# EAGLE design ChessPCB (EAGLE 9.6.2)
AUTHOR: C.AGENA, A.HUDAK; BOARD_NAME: CHESS_PCB; DOC_NUM: 1; PROJECT_NAME: CHESS_ROBOT; REVISION: 1
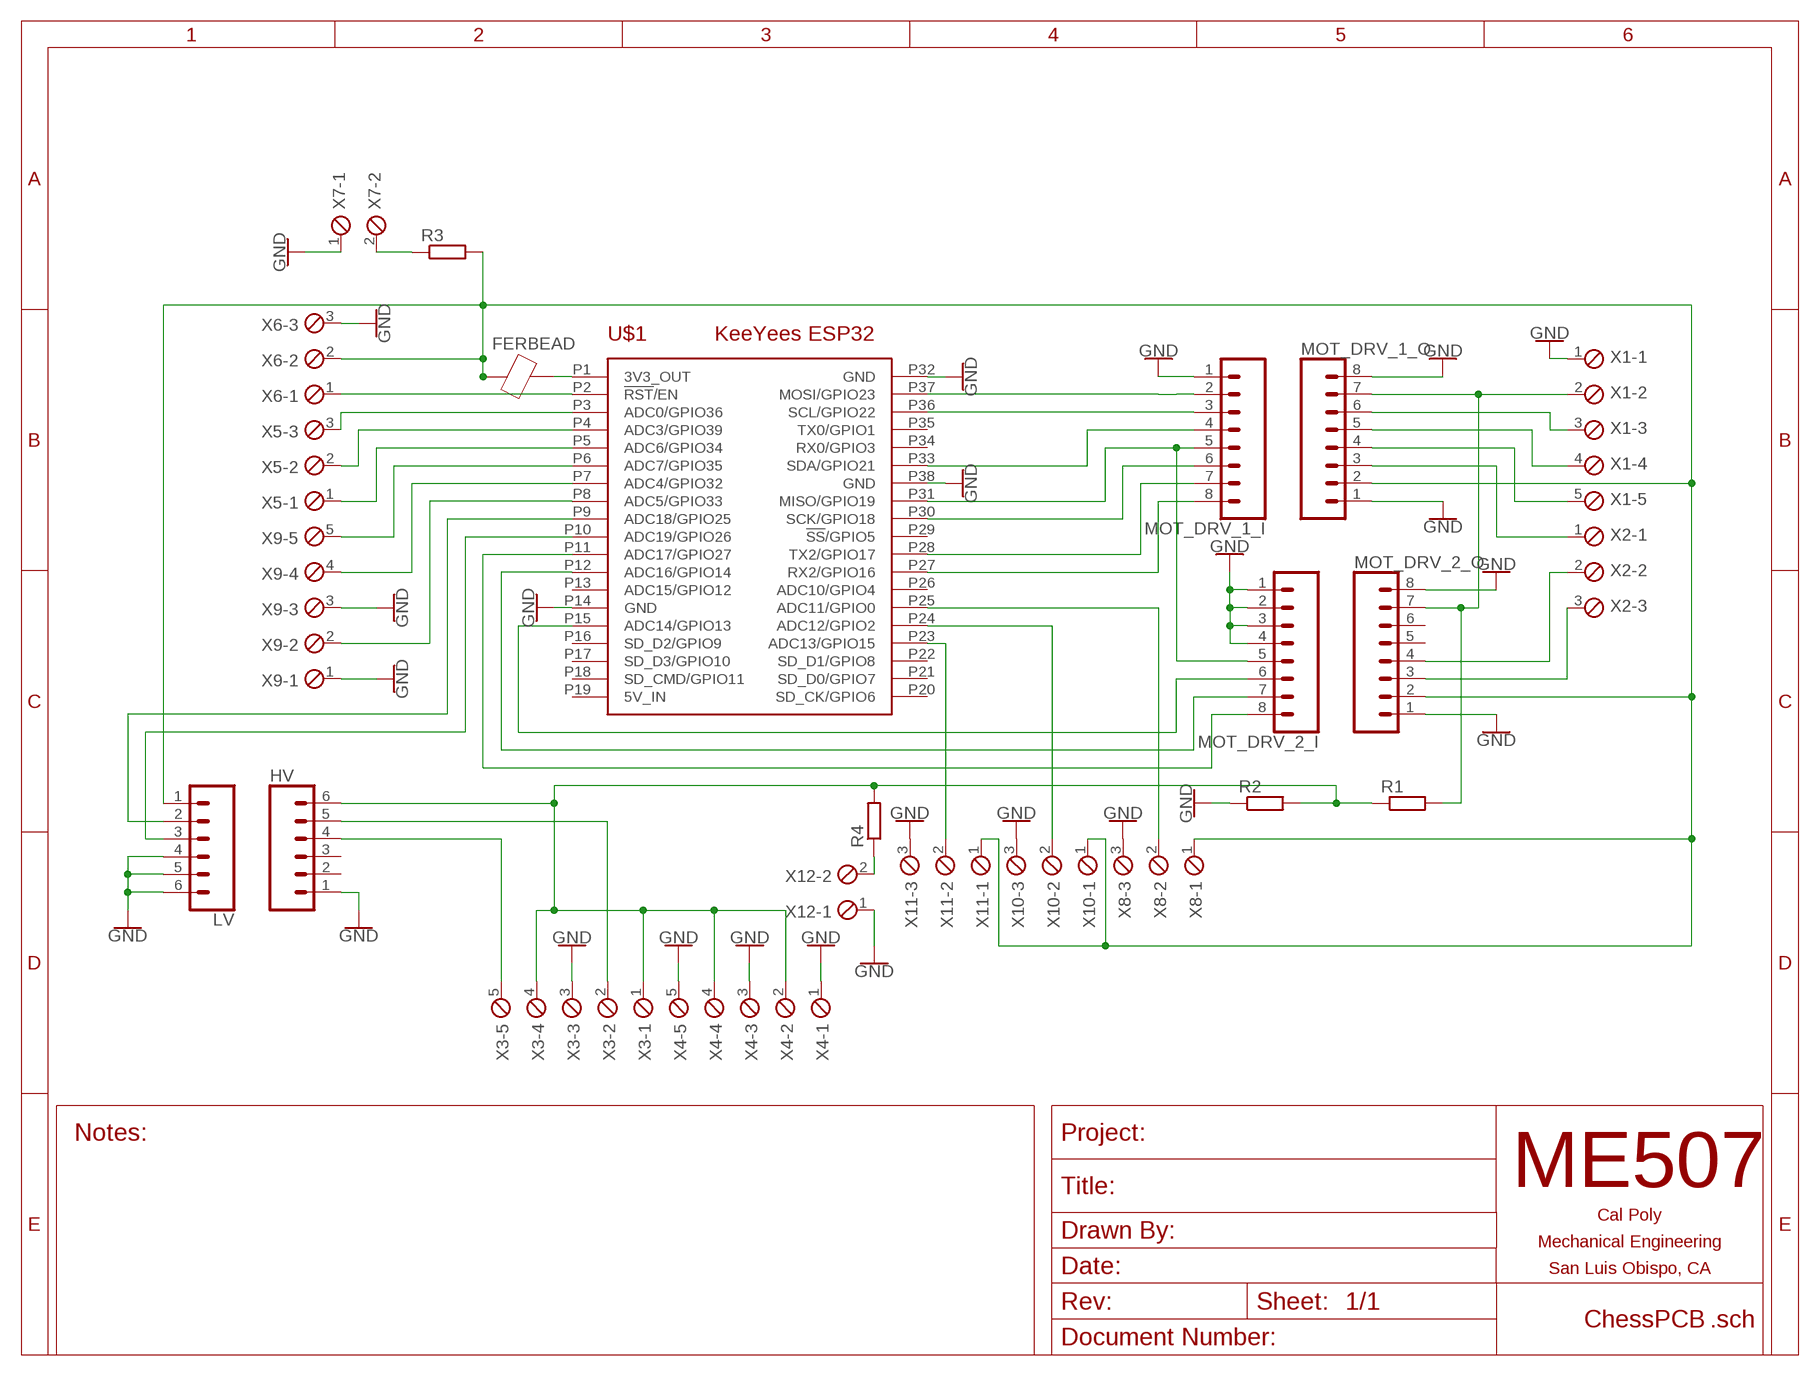
[diagram p0: schematic, sheet 1]

## Parts
FERBEAD  BEAD0402  [0402]
HV  CONN_06SILK_FEMALE_PTH  [1X06]
LV  CONN_06SILK_FEMALE_PTH  [1X06]
MOT_DRV_1_I  CONN_08"  [1X08]
MOT_DRV_1_O  CONN_08"  [1X08]
MOT_DRV_2_I  CONN_08"  [1X08]
MOT_DRV_2_O  CONN_08"  [1X08]
R1  R-EU_0204/7  [0204/7]
R2  R-EU_0204/7  [0204/7]
R3  R-EU_0204/7  [0204/7]
R4  R-EU_0204/7  [0204/7]
U$1  KEEYEES_ESP32  [KEEYEES_ESP32]
X1  SCREWTERM_5P_254  [5POL254]
X2  SCREWTERM_3P_254  [3POL254]
X3  SCREWTERM_5P_254  [5POL254]
X4  SCREWTERM_5P_254  [5POL254]
X5  SCREWTERM_3P_254  [3POL254]
X6  SCREWTERM_3P_254  [3POL254]
X7  SCREWTERM_2P_254  [2POL254]
X8  SCREWTERM_3P_254  [3POL254]
X9  SCREWTERM_5P_254  [5POL254]
X10  SCREWTERM_3P_254  [3POL254]
X11  SCREWTERM_3P_254  [3POL254]
X12  SCREWTERM_2P_254  [2POL254]

## Nets
GND: HV.1 LV.4 LV.5 LV.6 MOT_DRV_1_I.1 MOT_DRV_1_O.1 MOT_DRV_1_O.8 MOT_DRV_2_I.1 MOT_DRV_2_I.2 MOT_DRV_2_I.3 MOT_DRV_2_I.4 MOT_DRV_2_O.1 MOT_DRV_2_O.8 R2.1 U$1.P14(GND) U$1.P32(GND) U$1.P38(GND) X1.1 X3.3 X4.1 X4.3 X4.5 X6.3 X7.1 X8.3 X9.1 X9.3 X10.3 X11.3 X12.1
N$1: MOT_DRV_1_I.2 U$1.P37(MOSI/GPIO23)
N$2: MOT_DRV_1_I.3 U$1.P36(SCL/GPIO22)
N$3: MOT_DRV_1_I.4 U$1.P33(SDA/GPIO21)
N$4: MOT_DRV_1_I.6 U$1.P30(SCK/GPIO18)
N$5: MOT_DRV_1_I.7 U$1.P28(TX2/GPIO17)
N$6: MOT_DRV_1_I.8 U$1.P27(RX2/GPIO16)
N$7: MOT_DRV_1_I.5 MOT_DRV_2_I.5 U$1.P31(MISO/GPIO19)
N$8: LV.3 U$1.P10(ADC19/GPIO26)
N$9: MOT_DRV_2_I.8 U$1.P11(ADC17/GPIO27)
N$10: MOT_DRV_2_I.7 U$1.P12(ADC16/GPIO14)
N$11: MOT_DRV_2_I.6 U$1.P15(ADC14/GPIO13)
N$12: U$1.P3(ADC0/GPIO36) X5.3
N$13: U$1.P4(ADC3/GPIO39) X5.2
N$14: U$1.P5(ADC6/GPIO34) X5.1
N$15: U$1.P6(ADC7/GPIO35) X9.5
N$16: U$1.P7(ADC4/GPIO32) X9.4
N$17: LV.2 U$1.P9(ADC18/GPIO25)
N$18: U$1.P8(ADC5/GPIO33) X9.2
N$19: MOT_DRV_2_O.3 X2.3
N$20: FERBEAD.2 U$1.P1(3V3_OUT)
N$21: MOT_DRV_2_O.4 X2.2
N$22: R3.1 X7.2
N$23: FERBEAD.1 LV.1 MOT_DRV_1_O.2 MOT_DRV_2_O.2 R3.2 X6.2 X8.1 X10.1 X11.1
N$24: HV.6 R1.1 R2.2 R4.2 X3.1 X3.4 X4.2 X4.4
N$25: U$1.P25(ADC11/GPIO0) X8.2
N$26: U$1.P24(ADC12/GPIO2) X10.2
N$27: U$1.P23(ADC13/GPIO15) X11.2
N$28: U$1.P2(!RST!/EN) X6.1
N$29: HV.5 X3.2
N$30: MOT_DRV_1_O.7 MOT_DRV_2_O.7 R1.2 X1.2
N$31: HV.4 X3.5
N$32: R4.1 X12.2
N$33: MOT_DRV_1_O.6 X1.3
N$36: MOT_DRV_1_O.5 X1.4
N$37: MOT_DRV_1_O.4 X1.5
N$38: MOT_DRV_1_O.3 X2.1
Unconnected: HV.2 HV.3 MOT_DRV_2_O.5 MOT_DRV_2_O.6 U$1.P13(ADC15/GPIO12) U$1.P16(SD_D2/GPIO9) U$1.P17(SD_D3/GPIO10) U$1.P18(SD_CMD/GPIO11) U$1.P20(SD_CK/GPIO6) U$1.P21(SD_D0/GPIO7) U$1.P22(SD_D1/GPIO8) U$1.P26(ADC10/GPIO4) U$1.P29(!SS!/GPIO5) U$1.P34(RX0/GPIO3) U$1.P35(TX0/GPIO1)

## Power pins joined to a net without a drawn wire
5V_IN: U$1.P19(5V_IN)

## Library data of the parts
FERBEAD = ME507:BEAD: Ferrite Bead
HV LV = SparkFun-Connectors:CONN_06: Multi connection point. Often used as Generic Header-pin footprint for 0.1 inch spaced/style header connections On any of the 0.1 inch spaced packages, you can populate with these: Break Away Headers - Straight <https://www.sparkfun.com/products/116> (PRT-00116) Break Away Male Headers - Right Angle <https://www.sparkfun.com/products/553> (PRT-00553) Female Headers <https://www.sparkfun.com/products/115> (PRT-00115) Break Away Headers - Machine Pin <https://www.sparkfun.com/products/117> (PRT-00117) Break Away Female Headers - Swiss Machine Pin <https://www.sparkfun.com/products/743> (PRT-00743) Arduino Stackable Header - 6 Pin <https://www.sparkfun.com/products/9280> (PRT-09280) For SCREWTERMINALS and SPRING TERMINALS visit here: Screw Terimnals on SparkFun.com <https://www.sparkfun.com/search/results?term=Screw+Terminals> (5mm/3.5mm/2.54mm spacing) This device is also useful as a general connection point to wire up your design to another part of your project. Our various solder wires solder well into these plated through hole pads. Hook-Up Wire - Assortment (Stranded, 22 AWG) <https://www.sparkfun.com/products/11375> (PRT-11375) Hook-Up Wire - Assortment (Solid Core, 22 AWG) <https://www.sparkfun.com/products/11367> (PRT-11367) View the entire wire category on our website here <https://www.sparkfun.com/categories/141>; PROD_ID: CONN-08437
MOT_DRV_1_I MOT_DRV_1_O MOT_DRV_2_I MOT_DRV_2_O = SparkFun-Connectors:CONN_08: Multi connection point. Often used as Generic Header-pin footprint for 0.1 inch spaced/style header connections On any of the 0.1 inch spaced packages, you can populate with these: Break Away Headers - Straight <https://www.sparkfun.com/products/116> (PRT-00116) Break Away Male Headers - Right Angle <https://www.sparkfun.com/products/553> (PRT-00553) Female Headers <https://www.sparkfun.com/products/115> (PRT-00115) Break Away Headers - Machine Pin <https://www.sparkfun.com/products/117> (PRT-00117) Break Away Female Headers - Swiss Machine Pin <https://www.sparkfun.com/products/743> (PRT-00743) Arduino Stackable Header - 8 Pin <https://www.sparkfun.com/products/9279> (PRT-09279) For SCREWTERMINALS and SPRING TERMINALS visit here: Screw Terimnals on SparkFun.com <https://www.sparkfun.com/search/results?term=Screw+Terminals> (5mm/3.5mm/2.54mm spacing) This device is also useful as a general connection point to wire up your design to another part of your project. Our various solder wires solder well into these plated through hole pads. Hook-Up Wire - Assortment (Stranded, 22 AWG) <https://www.sparkfun.com/products/11375> (PRT-11375) Hook-Up Wire - Assortment (Solid Core, 22 AWG) <https://www.sparkfun.com/products/11367> (PRT-11367) View the entire wire category on our website here <https://www.sparkfun.com/categories/141> Special notes: Molex polarized connector foot print use with SKU : PRT-08231 with associated crimp pins and housings. 1MM SMD Version SKU: PRT-10208 NOTES ON THE VARIANTS LOCK and LOCK_LONGPADS... This footprint was designed to help hold the alignment of a through-hole component (i.e. 6-pin header) while soldering it into place. You may notice that each hole has been shifted either up or down by 0.005 of an inch from it's more standard position (which is a perfectly straight line). This slight alteration caused the pins (the squares in the middle) to touch the edges of the holes. Because they are alternating, it causes a "brace" to hold the component in place. 0.005 has proven to be the perfect amount of "off-center" position when using our standard breakaway headers. Although looks a little odd when you look at the bare footprint, once you have a header in there, the alteration is very hard to notice. Also,if you push a header all the way into place, it is covered up entirely on the bottom side.; PROD_ID: CONN-08438
R1-R4 = rcl:R-EU_: RESISTOR, European symbol; SPICEPREFIX: R
U$1 = ME507:KEEYEES_ESP32: Footprint for an add-on board (shield, hat, etc.) for a KeeYees ESP32 development board with ESP-WROOM-32 module. 38 pins.
X1 X3 X4 X9 = ME507:SCREWTERM_5P: Screw Terminal Block This part is designed for a screw terminal connector. The 2.54mm (0.100 inch) foorprint can also be used for male or female pin headers such as those on most development boards. One can also solder wires directly into the holes, though this makes modifications or repairs to the system more inconvenient. Larger versions can carry more current.
X2 X5 X6 X8 X10 X11 = ME507:SCREWTERM_3P: Screw Terminal Block This part is designed for a screw terminal connector. The 2.54mm (0.100 inch) foorprint can also be used for male or female pin headers such as those on most development boards. One can also solder wires directly into the holes, though this makes modifications or repairs to the system more inconvenient. Larger versions can carry more current.
X7 X12 = ME507:SCREWTERM_2P: Screw Terminal Block This part is designed for a screw terminal connector. The 2.54mm (0.100 inch) foorprint can also be used for male or female pin headers such as those on most development boards. One can also solder wires directly into the holes, though this makes modifications or repairs to the system more inconvenient. Larger versions can carry more current.

## Board
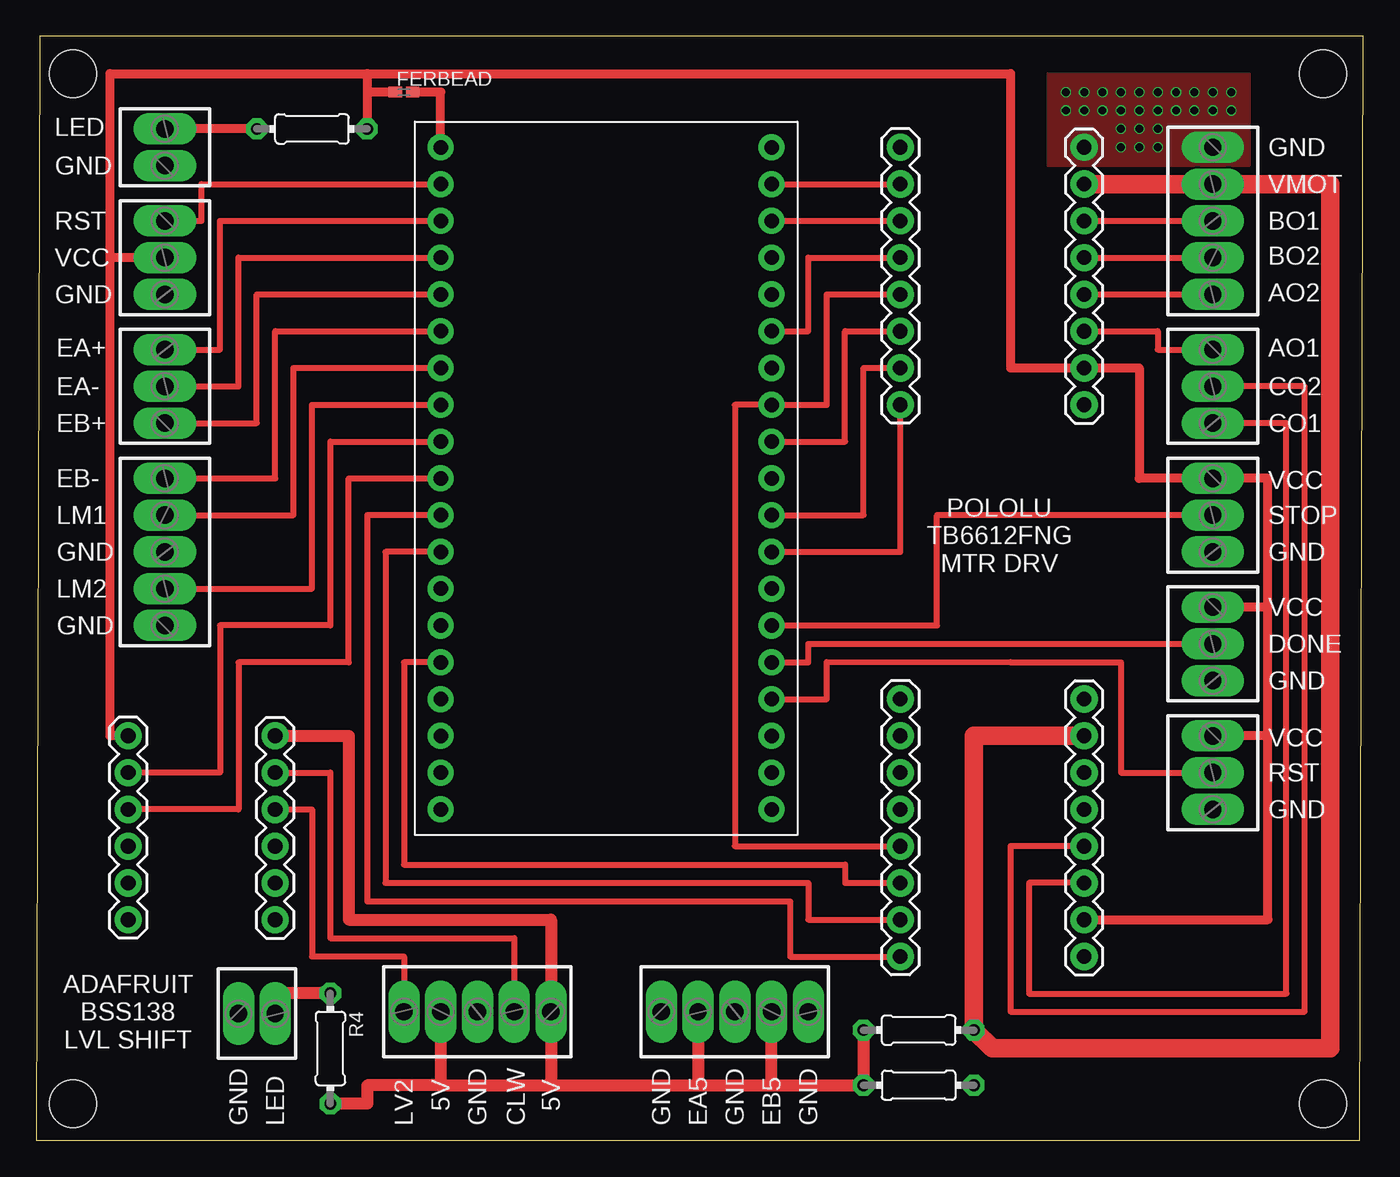
[diagram p1: board, top side]
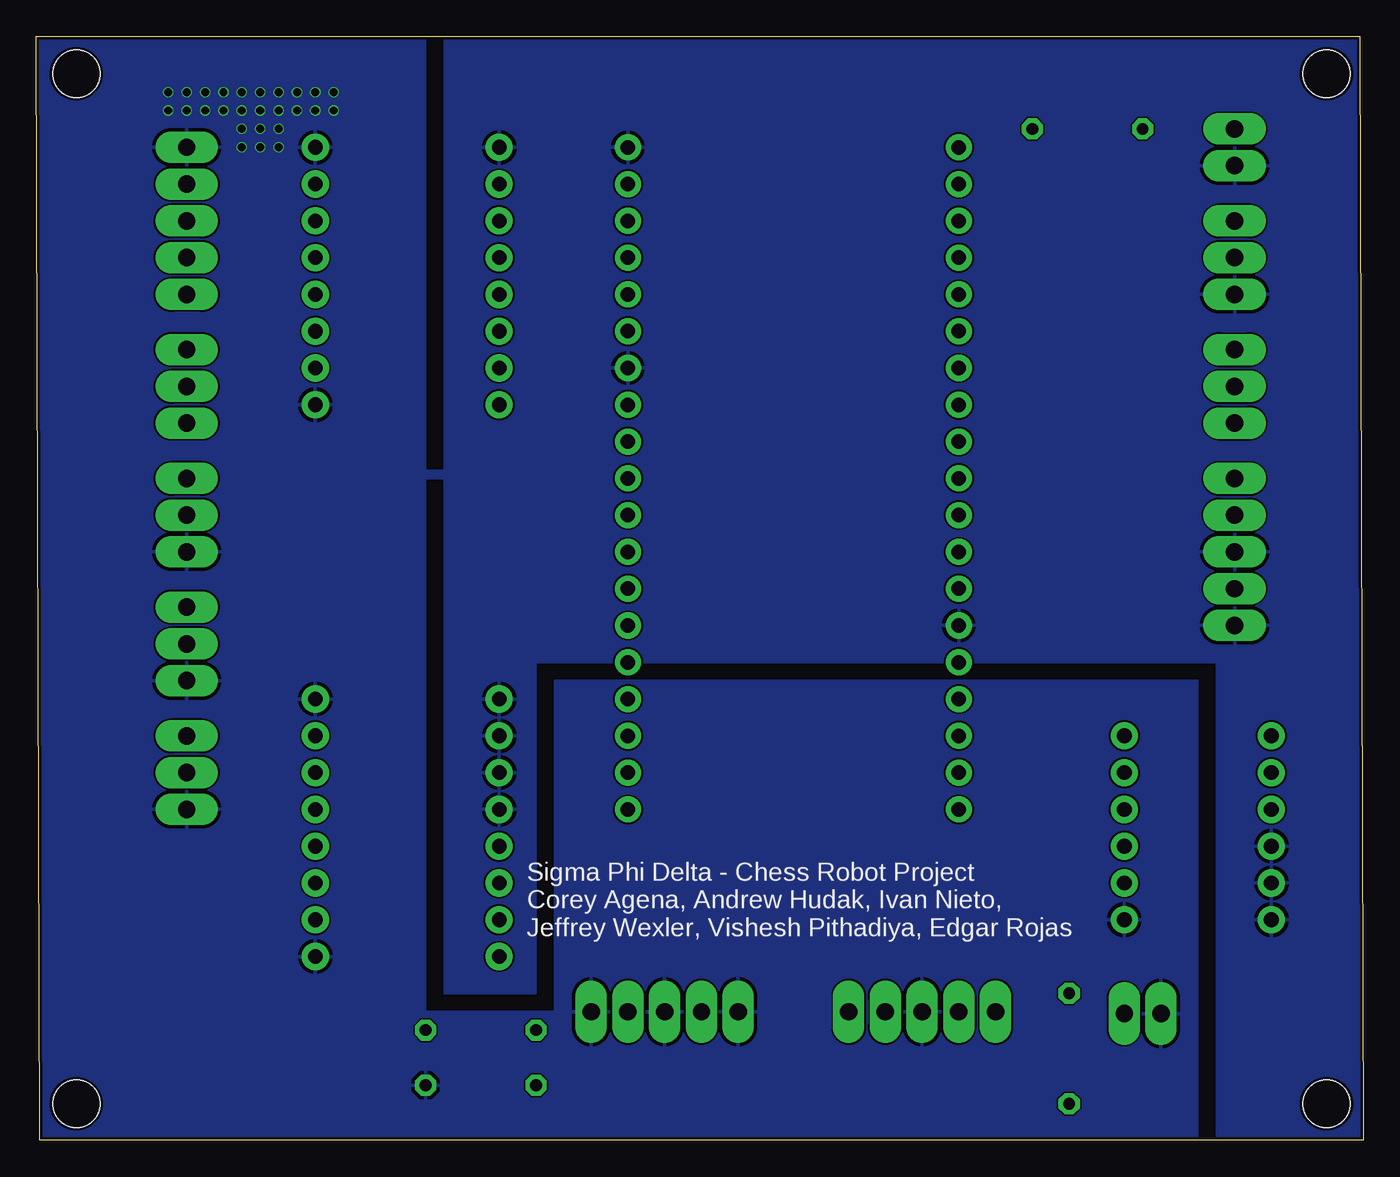
[diagram p2: board, bottom side, seen from below]

Size 91.67 x 76.25 mm. Coordinates in mm from the lower left corner, seen from the top.
Outline: 0,0 91.42,0 91.67,76.25 0.25,76.25 0,0
Copper layers (1*16): Top 0.035mm / dielectric 1.6mm / Bottom 0.035mm
Design rules "jlcpcb-2layers": minimum track width 5mil, minimum drill 0.3mm, track to track 5mil, track to pad 5mil, pad to pad 5mil, via to via 5mil, smd to smd 5mil, copper to edge 0.2mm, drill to drill 6mil, minimum pad ring 10mil, minimum via ring 3mil, stop-mask expansion 4mil, vias tented up to drill 0mil, thermal gap 10mil
Holes 3.26 mm at 2.54,73.66 2.54,2.54 88.9,73.66 88.9,2.54

### Footprints (pad centres in the part's own frame; a part is rotated, then mirrored left to right if it is on the bottom)
0402 = smd 0.925 x 0.74: 1 -0.6,0; 2 0.6,0
1X06 = drill 1.016 pad 1.88: 1 0,0; 2 2.54,0; 3 5.08,0; 4 7.62,0; 5 10.16,0; 6 12.7,0
1X08 = drill 1.016 pad 1.88: 1 0,0; 2 2.54,0; 3 5.08,0; 4 7.62,0; 5 10.16,0; 6 12.7,0; 7 15.24,0; 8 17.78,0
0204/7 = drill 0.813 octagon: 1 -3.81,0; 2 3.81,0
KEEYEES_ESP32 = drill 1 pad 1.778: P1 -11.43,21.59; P2 -11.43,19.05; P3 -11.43,16.51; P4 -11.43,13.97; P5 -11.43,11.43; P6 -11.43,8.89; P7 -11.43,6.35; P8 -11.43,3.81; P9 -11.43,1.27; P10 -11.43,-1.27; P11 -11.43,-3.81; P12 -11.43,-6.35; P13 -11.43,-8.89; P14 -11.43,-11.43; P15 -11.43,-13.97; P16 -11.43,-16.51; P17 -11.43,-19.05; P18 -11.43,-21.59; P19 -11.43,-24.13; P20 11.43,-24.13; P21 11.43,-21.59; P22 11.43,-19.05; P23 11.43,-16.51; P24 11.43,-13.97; P25 11.43,-11.43; P26 11.43,-8.89; P27 11.43,-6.35; P28 11.43,-3.81; P29 11.43,-1.27; P30 11.43,1.27; P31 11.43,3.81; P32 11.43,6.35; P33 11.43,8.89; P34 11.43,11.43; P35 11.43,13.97; P36 11.43,16.51; P37 11.43,19.05; P38 11.43,21.59
5POL254 = drill 1.2 long: 1 -5.08,0; 2 -2.54,0; 3 0,0; 4 2.54,0; 5 5.08,0
3POL254 = drill 1.2 long: 1 -2.54,0; 2 0,0; 3 2.54,0
2POL254 = drill 1.2 long: 1 -1.27,0; 2 1.27,0

### Placement (x,y rotation side)
FERBEAD  25.4,72.39 0 top
HV  16.51,15.24 90 top
LV  6.35,27.94 270 top
MOT_DRV_1_I  59.69,68.58 270 top
MOT_DRV_1_O  72.39,50.8 90 top
MOT_DRV_2_I  59.69,30.48 270 top
MOT_DRV_2_O  72.39,12.7 90 top
R1  60.96,7.62 0 top
R2  60.96,3.81 180 top
R3  19.05,69.85 0 top
R4  20.32,6.35 270 top
U$1  39.37,46.99 0 top
X1  81.28,63.5 270 top
X2  81.28,52.07 270 top
X3  30.48,8.89 180 top
X4  48.26,8.89 0 top
X5  8.89,52.07 90 top
X6  8.89,60.96 270 top
X7  8.89,68.58 90 top
X8  81.28,43.18 270 top
X9  8.89,40.64 90 top
X10  81.28,34.29 270 top
X11  81.28,25.4 270 top
X12  15.24,8.76 0 top

### Tracks (layer width: path | path; a pad name or v marks a point on that pad's centre or on a via)
GND  (via drill 0.55)
  other vias: 71.12,72.39 72.39,72.39 73.66,72.39 82.55,71.12 71.12,71.12 72.39,71.12 74.93,72.39 76.2,72.39 77.47,72.39 81.28,72.39 82.55,72.39 78.74,72.39 80.01,72.39 73.66,71.12 74.93,71.12 76.2,71.12 77.47,71.12 78.74,71.12 80.01,71.12 81.28,71.12 74.93,69.85 76.2,69.85 77.47,69.85 74.93,68.58 76.2,68.58 77.47,68.58
  pour Top (no thermals): 71.12,67.31 83.82,67.31 83.82,73.66 69.85,73.66 69.85,67.31
  pour Bottom: 0,0 0,76.2 63.5,76.2 63.5,46.23 64.77,46.23 64.77,76.2 91.44,76.2 91.44,0 11.43,0 11.43,31.75 55.88,31.75 55.88,8.89 64.77,8.89 64.77,45.72 63.5,45.72 63.5,10.16 57.15,10.16 57.15,33.02 10.16,33.02 10.16,0
N$1
  Top 0.406: U$1.P37 MOT_DRV_1_I.2
N$2
  Top 0.406: U$1.P36 MOT_DRV_1_I.3
N$3
  Top 0.406: U$1.P33 53.34,55.88 53.34,60.96 MOT_DRV_1_I.4
N$4
  Top 0.406: U$1.P30 55.88,48.26 55.88,55.88 MOT_DRV_1_I.6
N$5
  Top 0.406: U$1.P28 57.15,43.18 57.15,53.34 MOT_DRV_1_I.7
N$6
  Top 0.406: U$1.P27 59.69,40.64 MOT_DRV_1_I.8
N$7
  Top 0.406: MOT_DRV_1_I.5 54.61,58.42 54.61,50.8 U$1.P31 48.26,50.8 48.26,20.32 MOT_DRV_2_I.5
N$8
  Top 0.406: U$1.P10 21.59,45.72 21.59,33.02 13.97,33.02 13.97,22.86 LV.3
N$9
  Top 0.406: U$1.P11 22.86,43.18 22.86,16.51 52.07,16.51 52.07,12.7 MOT_DRV_2_I.8
N$10
  Top 0.406: U$1.P12 24.13,40.64 24.13,17.78 53.34,17.78 53.34,15.24 MOT_DRV_2_I.7
N$11
  Top 0.406: U$1.P15 25.4,33.02 25.4,19.05 55.88,19.05 55.88,17.78 MOT_DRV_2_I.6
N$12
  Top 0.406: X5.3 12.7,54.61 12.7,63.5 U$1.P3
N$13
  Top 0.406: X5.2 13.97,52.07 13.97,60.96 U$1.P4
N$14
  Top 0.406: X5.1 15.24,49.53 15.24,58.42 U$1.P5
N$15
  Top 0.406: X9.5 16.51,45.72 16.51,55.88 U$1.P6
N$16
  Top 0.406: X9.4 17.78,43.18 17.78,53.34 U$1.P7
N$17
  Top 0.406: U$1.P9 20.32,48.26 20.32,35.56 12.7,35.56 12.7,25.4 LV.2
N$18
  Top 0.406: X9.2 19.05,38.1 19.05,50.8 U$1.P8
N$19
  Top 0.406: MOT_DRV_2_O.3 68.58,17.78 68.58,10.13 86.36,10.13 86.36,49.53 X2.3
N$20
  Top 0.61: U$1.P1 27.94,72.39 FERBEAD.2
N$21
  Top 0.406: MOT_DRV_2_O.4 67.31,20.32 67.31,8.89 87.63,8.89 87.63,52.07 X2.2
N$22
  Top 0.61: R3.1 X7.2
N$23
  Top 0.406: 22.86,72.39 R3.2
  Top 0.61: FERBEAD.1 22.86,72.39 | X6.2 5.08,60.96 | 5.08,60.96 5.08,73.66 22.86,73.66 | 22.86,73.66 R3.2 | 5.08,60.96 5.08,27.94 LV.1 | 22.86,73.66 67.31,73.66 67.31,53.34 MOT_DRV_1_O.2 76.2,53.34 76.2,45.72 X8.1 85.09,45.72 85.09,36.83 | MOT_DRV_2_O.2 85.09,15.24 85.09,27.94 | 85.09,27.94 X11.1 | 85.09,27.94 85.09,36.83 | 85.09,36.83 X10.1
N$24
  Top 0.813: HV.6 21.59,27.94 21.59,15.24 35.56,15.24 X3.1 35.56,3.81 | X3.4 27.94,3.81 | 27.94,3.81 35.56,3.81 | 35.56,3.81 45.72,3.81 | X4.2 45.72,3.81 | R1.1 R2.2 50.8,3.81 | 50.8,3.81 X4.4 | 45.72,3.81 50.8,3.81 | 27.94,3.81 22.86,3.81 22.86,2.54 R4.2
N$25
  Top 0.406: U$1.P25 62.23,35.56 62.23,43.18 X8.2
N$26
  Top 0.406: U$1.P24 53.34,33.02 53.34,34.29 X10.2
N$27
  Top 0.406: U$1.P23 54.61,30.48 54.61,33.05 67.3,33.03 67.31,33.02 74.93,33.02 74.93,25.4 X11.2
N$28
  Top 0.406: X6.1 11.43,63.5 11.43,66.04 U$1.P2
N$29
  Top 0.406: HV.5 20.32,25.4 20.32,13.97 33.02,13.97 X3.2
N$30
  Top 1.27: MOT_DRV_2_O.7 64.77,27.94 R1.2 66.04,6.35 89.41,6.35 89.41,66.04 X1.2 MOT_DRV_1_O.7
N$31
  Top 0.406: HV.4 19.05,22.86 19.05,12.7 25.4,12.7 X3.5
N$32
  Top 0.813: R4.1 16.51,10.16 X12.2
N$33
  Top 0.406: MOT_DRV_1_O.6 X1.3
N$36
  Top 0.406: MOT_DRV_1_O.5 X1.4
N$37
  Top 0.406: MOT_DRV_1_O.4 X1.5
N$38
  Top 0.406: X2.1 77.47,54.61 77.47,55.88 MOT_DRV_1_O.3

### Text on the board
tNames: LED | GND | GND | VMOT | RST | BO1 | VCC | BO2 | GND | AO2 | EA+ | AO1 | EA- | CO2 | EB+ | CO1 | EB- | VCC | LM1 | STOP | POLOLU / TB6612FNG / MTR DRV | GND | GND | LM2 | VCC | GND | DONE | GND | VCC | RST | GND | ADAFRUIT / BSS138 / LVL SHIFT | 5V | 5V | GND | LED | LV2 | GND | CLW | GND | EA5 | GND | EB5 | GND
bNames: Sigma Phi Delta - Chess Robot Project / Corey Agena, Andrew Hudak, Ivan Nieto, / Jeffrey Wexler, Vishesh Pithadiya, Edgar Rojas